# Altium schematic sheet Top Layer.SchDoc
size A4
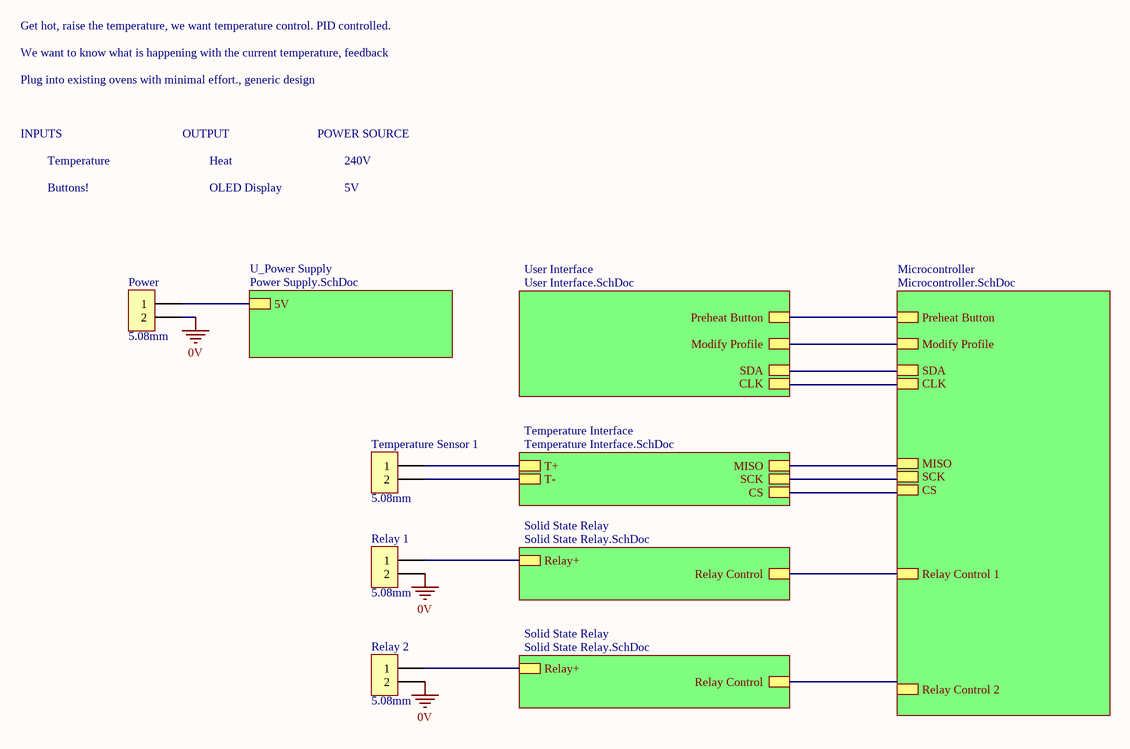
[diagram p0: Top Layer.SchDoc]

## Parts
Power  5.08mm  [TH 5.08mm Header 1x2]
Relay_1  5.08mm  [TH 5.08mm Header 1x2]
Relay_2  5.08mm  [TH 5.08mm Header 1x2]
Temperature_Sensor_1  5.08mm  [TH 5.08mm Header 1x2]

## Sub-sheets
Microcontroller = Microcontroller.SchDoc: Preheat Button, Modify Profile, Relay Control 1, MISO, CS, SCK, SDA, CLK, Relay Control 2
Solid State Relay = Solid State Relay.SchDoc: Relay Control, Relay+
Solid State Relay = Solid State Relay.SchDoc: Relay Control, Relay+
Temperature Interface = Temperature Interface.SchDoc: T+, T-, MISO, CS, SCK
U_Power Supply = Power Supply.SchDoc: 5V
User Interface = User Interface.SchDoc: Preheat Button, Modify Profile, SDA, CLK

## Nets
0V: Power.2 Relay_1.2 Relay_2.2
NetPower_1: Power.1 ; sheet U_Power Supply/5V
NetRelay_1_1: Relay_1.1 ; sheet Solid State Relay/Relay+
NetRelay_2_1: Relay_2.1 ; sheet Solid State Relay/Relay+
NetTemperature_Sensor_1_1: Temperature_Sensor_1.1 ; sheet Temperature Interface/T+
(unnamed): sheet Microcontroller/Preheat Button, sheet User Interface/Preheat Button
(unnamed): sheet Microcontroller/Relay Control 1, sheet Solid State Relay/Relay Control

Not connected (* = marked no-connect by the designer): Temperature_Sensor_1 2

## Notes on the sheet
- Get hot, raise the temperature, we want temperature control. PID controlled.
- We want to know what is happening with the current temperature, feedback
- Plug into existing ovens with minimal effort., generic design
- INPUTS
- OUTPUT
- POWER SOURCE
- Temperature
- Buttons!
- Heat
- OLED Display
- 240V
- 5V

## Library data of the parts
Power Relay_1 Relay_2 Temperature_Sensor_1 = 1760510000: Positions: 2; Row Spacing: 0; Flange: No; Contact: NA; Part Number: 1760510000; Pitch: 5.08mm; Angle: 0; Digikey Part Number: 281-1882-ND; Digikey Link: https://www.digikey.com.au/product-detail/en/weidm%C3%BCller/1760510000/281-1882-ND/459739